# EAGLE design control_module (EAGLE 7.4.0)
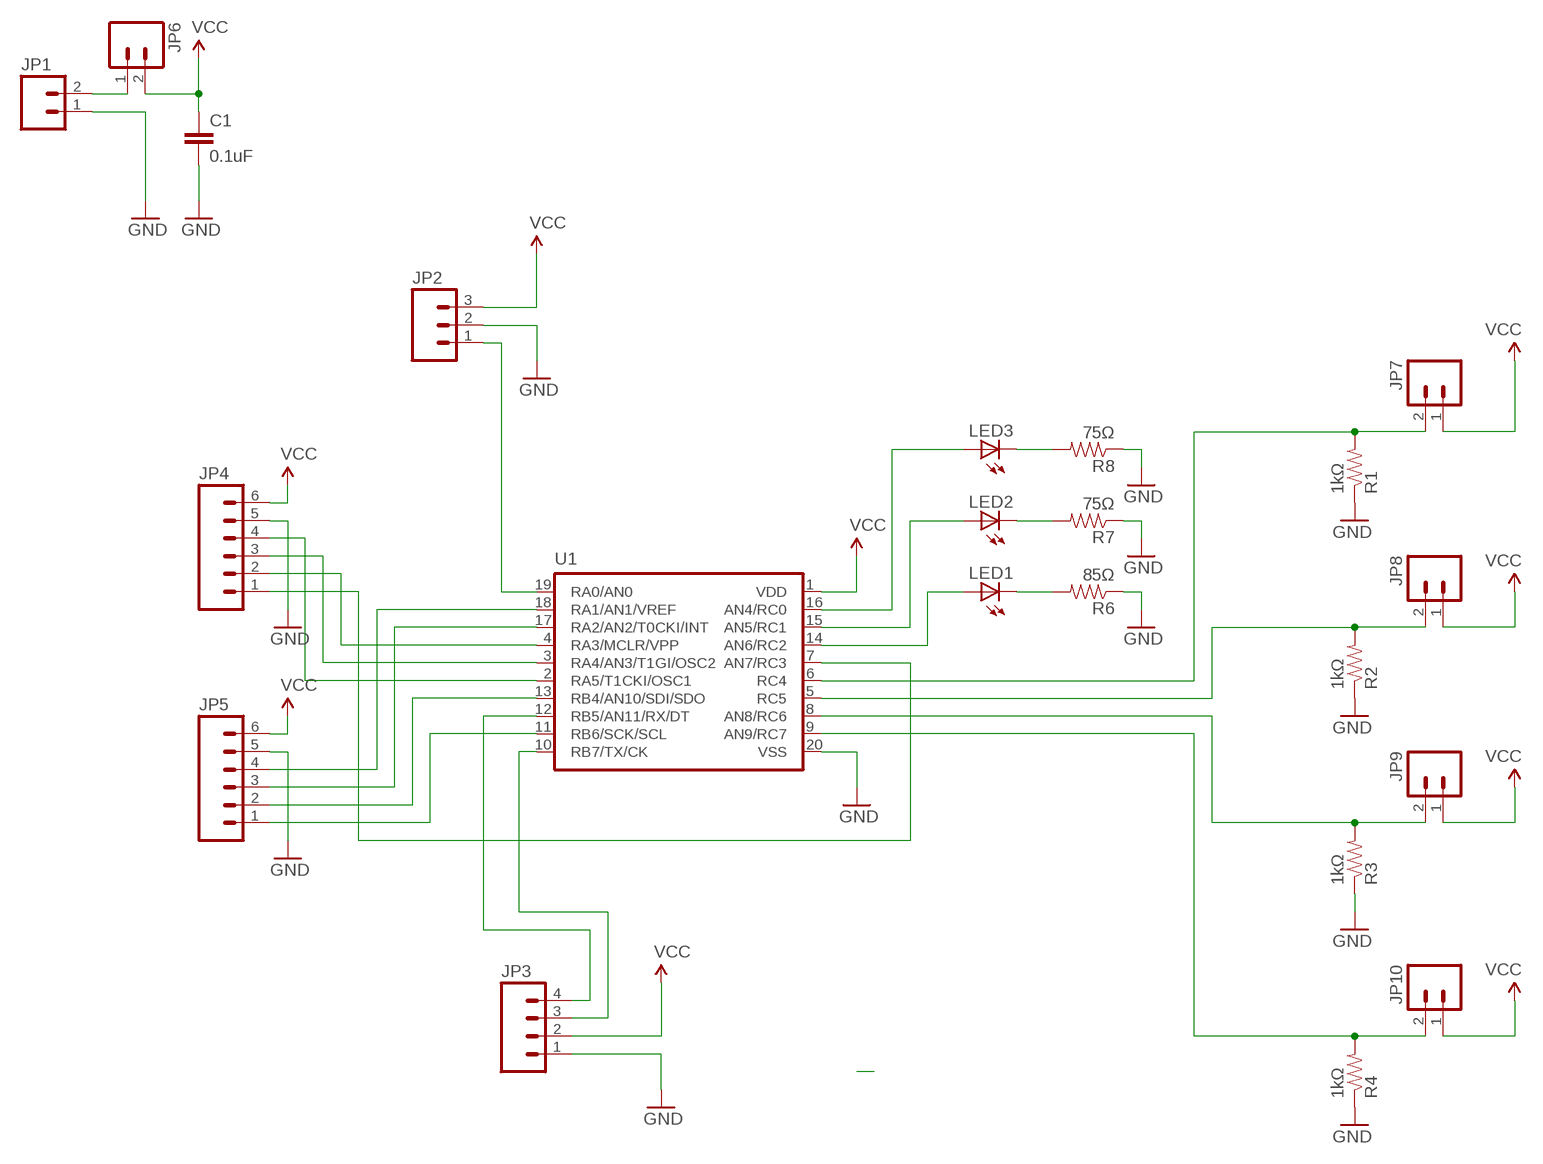
[diagram p0: schematic, sheet 1]

## Parts
C1  0.1uF  CAPPTH1  [CAP-PTH-5MM]
JP1  M02PTH  [1X02]
JP2  M03PTH  [1X03]
JP3  M04PTH  [1X04]
JP4  M06SILK_FEMALE_PTH  [1X06]
JP5  M06SILK_FEMALE_PTH  [1X06]
JP6  M02PTH  [1X02]
JP7  M02PTH  [1X02]
JP8  M02PTH  [1X02]
JP9  M02PTH  [1X02]
JP10  M02PTH  [1X02]
LED1  LED3MM  [LED3MM]
LED2  LED3MM  [LED3MM]
LED3  LED3MM  [LED3MM]
R1  1kΩ  RESISTORPTH-1/4W  [AXIAL-0.4]
R2  1kΩ  RESISTORPTH-1/4W  [AXIAL-0.4]
R3  1kΩ  RESISTORPTH-1/4W  [AXIAL-0.4]
R4  1kΩ  RESISTORPTH-1/4W  [AXIAL-0.4]
R6  85Ω  RESISTORPTH-1/4W  [AXIAL-0.4]
R7  75Ω  RESISTORPTH-1/4W  [AXIAL-0.4]
R8  75Ω  RESISTORPTH-1/4W  [AXIAL-0.4]
U1  PIC16F6XX  [DIL20]

## Nets
GND [power]: C1.2 JP1.1 JP2.2 JP3.1 JP4.5 JP5.5 R1.P$1 R2.P$1 R3.P$1 R4.P$1 R6.P$1 R7.P$1 R8.P$1 U1.20(VSS)
N$1: JP8.2 R2.P$2 U1.5(RC5)
N$2: JP9.2 R3.P$2 U1.8(AN8/RC6)
N$3: JP3.4 U1.12(RB5/AN11/RX/DT)
N$4: JP10.2 R4.P$2 U1.9(AN9/RC7)
N$5: JP2.1 U1.19(RA0/AN0)
N$6: LED3.A U1.16(AN4/RC0)
N$7: LED1.K(C) R6.P$2
N$8: LED2.A U1.15(AN5/RC1)
N$9: LED2.K(C) R7.P$2
N$10: LED1.A U1.14(AN6/RC2)
N$11: LED3.K(C) R8.P$2
N$13: JP3.3 U1.10(RB7/TX/CK)
N$15: JP4.1 U1.7(AN7/RC3)
N$16: JP4.2 U1.4(RA3/MCLR/VPP)
N$17: JP4.3 U1.3(RA4/AN3/T1GI/OSC2)
N$18: JP4.4 U1.2(RA5/T1CKI/OSC1)
N$19: JP5.4 U1.18(RA1/AN1/VREF)
N$20: JP5.3 U1.17(RA2/AN2/T0CKI/INT)
N$21: JP5.2 U1.13(RB4/AN10/SDI/SDO)
N$22 [power]: JP1.2 JP6.1
N$23: JP7.2 R1.P$2 U1.6(RC4)
N$24: JP5.1 U1.11(RB6/SCK/SCL)
VCC [power]: C1.1 JP2.3 JP3.2 JP4.6 JP5.6 JP6.2 JP7.1 JP8.1 JP9.1 JP10.1 U1.1(VDD)

## Library data of the parts
C1 = SparkFun-Capacitors:CAP: Capacitor Standard 0603 ceramic capacitor, and 0.1" leaded capacitor.
JP1 JP6-JP10 = SparkFun-Connectors:M02: Standard 2-pin 0.1" header. Use with - straight break away headers ( PRT-00116) - right angle break away headers (PRT-00553) - swiss pins (PRT-00743) - machine pins (PRT-00117) - female headers (PRT-00115) Molex polarized connector foot print use with: PRT-08233 with associated crimp pins and housings. 2.54_SCREWTERM for use with PRT-10571. 3.5mm Screw Terminal footprints for PRT-08084 5mm Screw Terminal footprints for use with PRT-08432
JP2 = SparkFun-Connectors:M03: Header 3 Standard 3-pin 0.1" header. Use with straight break away headers (SKU : PRT-00116), right angle break away headers (PRT-00553), swiss pins (PRT-00743), machine pins (PRT-00117), and female headers (PRT-00115). Molex polarized connector foot print use with SKU : PRT-08232 with associated crimp pins and housings.
JP3 = SparkFun-Connectors:M04: Header 4 Standard 4-pin 0.1" header. Use with straight break away headers (SKU : PRT-00116), right angle break away headers (PRT-00553), swiss pins (PRT-00743), machine pins (PRT-00117), and female headers (PRT-00115). Molex polarized connector foot print use with SKU : PRT-08231 with associated crimp pins and housings. 1MM SMD Version SKU: PRT-10208
JP4 JP5 = SparkFun-Connectors:M06: Header 6 Standard 6-pin 0.1" header. Use with straight break away headers (SKU : PRT-00116), right angle break away headers (PRT-00553), swiss pins (PRT-00743), machine pins (PRT-00117), and female headers (PRT-00115). Molex polarized connector foot print use with SKU : PRT-08094 with associated crimp pins and housings. NOTES ON THE VARIANTS LOCK and LOCK_LONGPADS... This footprint was designed to help hold the alignment of a through-hole component (i.e. 6-pin header) while soldering it into place. You may notice that each hole has been shifted either up or down by 0.005 of an inch from it's more standard position (which is a perfectly straight line). This slight alteration caused the pins (the squares in the middle) to touch the edges of the holes. Because they are alternating, it causes a "brace" to hold the component in place. 0.005 has proven to be the perfect amount of "off-center" position when using our standard breakaway headers. Although looks a little odd when you look at the bare footprint, once you have a header in there, the alteration is very hard to notice. Also,if you push a header all the way into place, it is covered up entirely on the bottom side. This idea of altering the position of holes to aid alignment will be further integrated into the Sparkfun Library for other footprints. It can help hold any component with 3 or more connection pins.; PROD_ID: CONN-08437
LED1-LED3 = led:LED: LED OSRAM: - CHIPLED LG R971, LG N971, LY N971, LG Q971, LY Q971, LO R971, LY R971 LH N974, LH R974 LS Q976, LO Q976, LY Q976 LO Q996 - Hyper CHIPLED LW Q18S LB Q993, LB Q99A, LB R99A - SideLED LS A670, LO A670, LY A670, LG A670, LP A670 LB A673, LV A673, LT A673, LW A673 LH A674 LY A675 LS A676, LA A676, LO A676, LY A676, LW A676 LS A679, LY A679, LG A679 - Hyper Micro SIDELED® LS Y876, LA Y876, LO Y876, LY Y876 LT Y87S - SmartLED LW L88C, LW L88S LB L89C, LB L89S, LG L890 LS L89K, LO L89K, LY L89K LS L896, LA L896, LO L896, LY L896 - TOPLED LS T670, LO T670, LY T670, LG T670, LP T670 LSG T670, LSP T670, LSY T670, LOP T670, LYG T670 LG T671, LOG T671, LSG T671 LB T673, LV T673, LT T673, LW T673 LH T674 LS T676, LA T676, LO T676, LY T676, LB T676, LH T676, LSB T676, LW T676 LB T67C, LV T67C, LT T67C, LS T67K, LO T67K, LY T67K, LW E67C LS E67B, LA E67B, LO E67B, LY E67B, LB E67C, LV E67C, LT E67C LW T67C LS T679, LY T679, LG T679 LS T770, LO T770, LY T770, LG T770, LP T770 LB T773, LV T773, LT T773, LW T773 LH T774 LS E675, LA E675, LY E675, LS T675 LS T776, LA T776, LO T776, LY T776, LB T776 LHGB T686 LT T68C, LB T68C - Hyper Mini TOPLED® LB M676 - Mini TOPLED Santana® LG M470 LS M47K, LO M47K, LY M47K Source: http://www.osram.convergy.de LUXEON: - LUMILED® LXK2-PW12-R00, LXK2-PW12-S00, LXK2-PW14-U00, LXK2-PW14-V00 LXK2-PM12-R00, LXK2-PM12-S00, LXK2-PM14-U00 LXK2-PE12-Q00, LXK2-PE12-R00, LXK2-PE12-S00, LXK2-PE14-T00, LXK2-PE14-U00 LXK2-PB12-K00, LXK2-PB12-L00, LXK2-PB12-M00, LXK2-PB14-N00, LXK2-PB14-P00, LXK2-PB14-Q00 LXK2-PR12-L00, LXK2-PR12-M00, LXK2-PR14-Q00, LXK2-PR14-R00 LXK2-PD12-Q00, LXK2-PD12-R00, LXK2-PD12-S00 LXK2-PH12-R00, LXK2-PH12-S00 LXK2-PL12-P00, LXK2-PL12-Q00, LXK2-PL12-R00 Source: www.luxeon.com KINGBRIGHT: KA-3528ASYC Source: www.kingbright.com
R1-R4 R6-R8 = SparkFun-Passives:RESISTOR: Resistor Basic schematic elements and footprints for 0603, 1206, and PTH resistors.
U1 = pic16f690:PIC16F6XX

## Net classes
1 power: width 0.406 mm

## Board
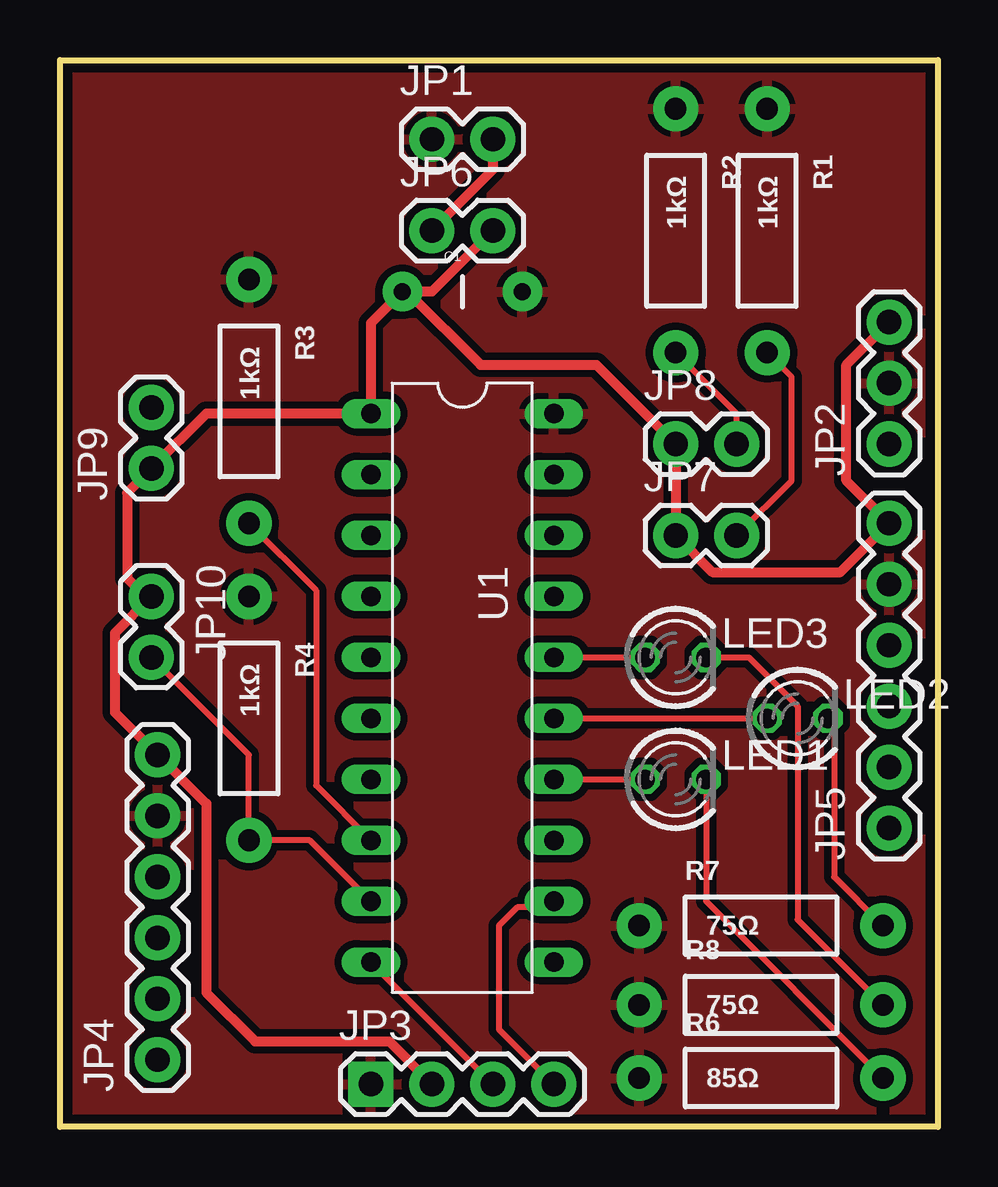
[diagram p1: board, top side]
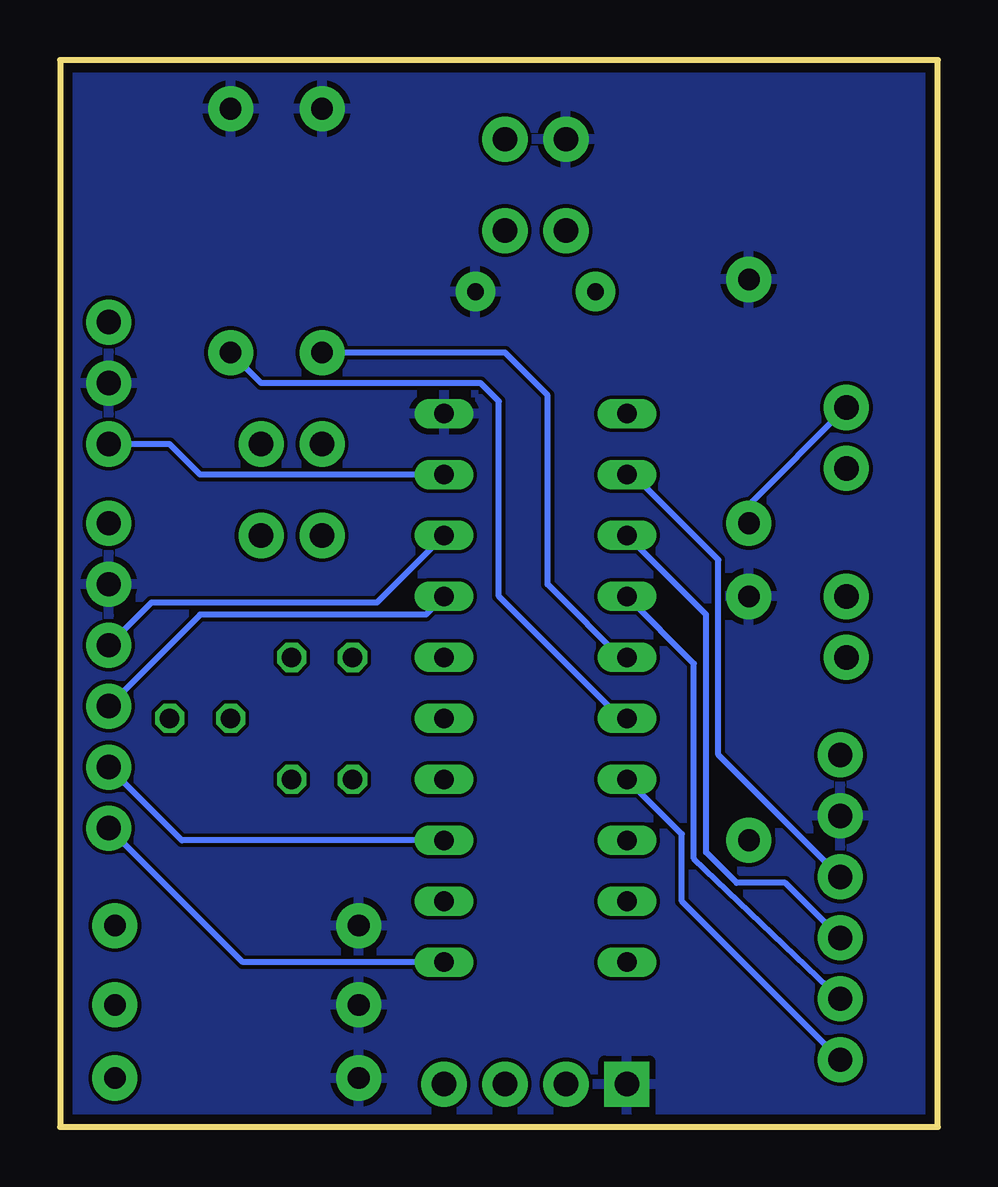
[diagram p2: board, bottom side, seen from below]

Size 36.58 x 44.45 mm. Coordinates in mm from the lower left corner, seen from the top.
Outline: 0,0 0,44.45 36.58,44.45 36.58,0 0,0
Copper layers (1*16): Top 0.0356mm / dielectric 1.5011mm / Bottom 0.0356mm
Design rules "LaenPCBOrder": minimum track width 6mil, minimum drill 13mil, track to track 6mil, track to pad 6mil, pad to pad 6mil, via to via 6mil, smd to smd 6mil, copper to edge 15mil, drill to drill 6mil, minimum pad ring 7mil, minimum via ring 7mil, stop-mask expansion 3mil, vias tented up to drill 0mil, thermal gap 10mil

### Footprints (pad centres in the part's own frame; a part is rotated, then mirrored left to right if it is on the bottom)
CAP-PTH-5MM = drill 0.7 pad 1.651: 1 -2.5,0; 2 2.5,0
1X02 = drill 1.016 pad 1.88: 1 0,0; 2 2.54,0
1X03 = drill 1.016 pad 1.88: 1 0,0; 2 2.54,0; 3 5.08,0
1X04 = drill 1.016 pad 1.88 square: 1 0,0 | drill 1.016 pad 1.88: 2 2.54,0; 3 5.08,0; 4 7.62,0
1X06 = drill 1.016 pad 1.88: 1 0,0; 2 2.54,0; 3 5.08,0; 4 7.62,0; 5 10.16,0; 6 12.7,0
LED3MM = drill 0.813 octagon: A -1.27,0; K 1.27,0
AXIAL-0.4 = drill 0.9 pad 1.88: P$1 -5.08,0; P$2 5.08,0
DIL20 = drill 0.813 long: 1 -11.43,-3.81; 2 -8.89,-3.81; 3 -6.35,-3.81; 4 -3.81,-3.81; 5 -1.27,-3.81; 6 1.27,-3.81; 7 3.81,-3.81; 8 6.35,-3.81; 9 8.89,-3.81; 10 11.43,-3.81; 11 11.43,3.81; 12 8.89,3.81; 13 6.35,3.81; 14 3.81,3.81; 15 1.27,3.81; 16 -1.27,3.81; 17 -3.81,3.81; 18 -6.35,3.81; 19 -8.89,3.81; 20 -11.43,3.81

### Placement (x,y rotation side)
C1  16.76,34.8 0 top
JP1  15.49,41.15 0 top
JP2  34.54,28.45 90 top
JP3  12.95,1.78 0 top
JP4  4.06,2.79 90 top
JP5  34.54,12.45 90 top
JP6  15.49,37.34 0 top
JP7  25.65,24.64 0 top
JP8  25.65,28.45 0 top
JP9  3.81,27.43 90 top
JP10  3.81,22.1 270 top
LED1  25.65,14.48 0 top
LED2  30.73,17.02 0 top
LED3  25.65,19.56 0 top
R1  29.46,37.34 270 top
R2  25.65,37.34 270 top
R3  7.87,30.23 270 top
R4  7.87,17.02 270 top
R6  29.21,2.03 0 top
R7  29.21,8.38 0 top
R8  29.21,5.08 0 top
U1  16.76,18.29 270 top

### Tracks (layer width: path | path; a pad name or v marks a point on that pad's centre or on a via)
GND
  pour Bottom: 0,0 0,44.45 36.58,44.45 36.58,0
  pour Top (isolate 0.305): 0,0 0,44.45 36.58,44.45 36.58,0
N$1
  Top 0.254: JP8.2 28.19,29.72 R2.P$2
  Bottom 0.254: U1.5 12.95,19.3 16.26,22.61 16.26,30.48 18.03,32.26 R2.P$2
N$2
  Top 0.254: R3.P$2 10.67,22.35 10.67,14.22 U1.8
  Bottom 0.254: JP9.2 7.87,25.91 R3.P$2
N$3
  Top 0.254: U1.12 20.57,9.14 19.05,9.14 18.29,8.38 18.29,4.06 JP3.4
N$4
  Top 0.254: U1.9 10.41,11.94 R4.P$2 7.87,15.49 JP10.2
N$5
  Bottom 0.254: U1.19 30.73,27.18 32,28.45 JP2.1
N$6
  Top 0.254: U1.16 LED3.A
N$7
  Top 0.254: LED1.K 26.92,9.4 R6.P$2
N$8
  Top 0.254: U1.15 LED2.A
N$9
  Top 0.254: LED2.K 32.26,16.76 32.26,10.41 R7.P$2
N$10
  Top 0.254: U1.14 LED1.A
N$11
  Top 0.254: LED3.K 28.7,19.56 30.73,17.53 30.73,8.64 R8.P$2
N$13
  Top 0.254: U1.10 JP3.3
N$15
  Bottom 0.254: JP4.1 10.67,9.4 10.67,12.19 U1.7
N$16
  Bottom 0.254: JP4.2 10.16,11.18 10.16,19.3 U1.4
N$17
  Bottom 0.254: JP4.3 6.35,10.16 8.38,10.16 9.65,11.43 9.65,21.34 U1.3
N$18
  Bottom 0.254: JP4.4 9.14,15.49 9.14,23.62 12.7,27.18 U1.2
N$19
  Bottom 0.254: U1.18 23.37,21.84 32.77,21.84 JP5.4
N$20
  Bottom 0.254: U1.17 21.34,21.34 30.73,21.34 JP5.3
N$21
  Bottom 0.254: U1.13 31.5,11.94 JP5.2
N$22
  Top 0.406: JP1.2 18.03,39.88 JP6.1
N$23
  Top 0.254: JP7.2 30.48,26.92 30.48,31.24 R1.P$2
  Bottom 0.254: U1.6 13.21,17.02 18.29,22.1 18.29,30.23 19.05,30.99 28.19,30.99 R1.P$2
N$24
  Bottom 0.254: U1.11 28.96,6.86 JP5.1
VCC
  Top 0.406: JP6.2 15.49,34.8 14.48,34.8 | 14.48,34.8 C1.1 12.95,33.49 U1.1 6.1,29.72 JP9.1 2.79,26.42 2.79,22.86 3.56,22.1 JP10.1 2.29,20.57 2.29,17.27 JP4.6 6.1,13.46 6.1,5.59 8.13,3.56 13.72,3.56 JP3.2 | 14.48,34.8 17.53,31.75 22.35,31.75 JP8.1 JP7.1 27.18,23.11 32.51,23.11 JP5.6 32.77,26.92 32.77,31.75 JP2.3